# Altium project SensorNode.PrjPcb
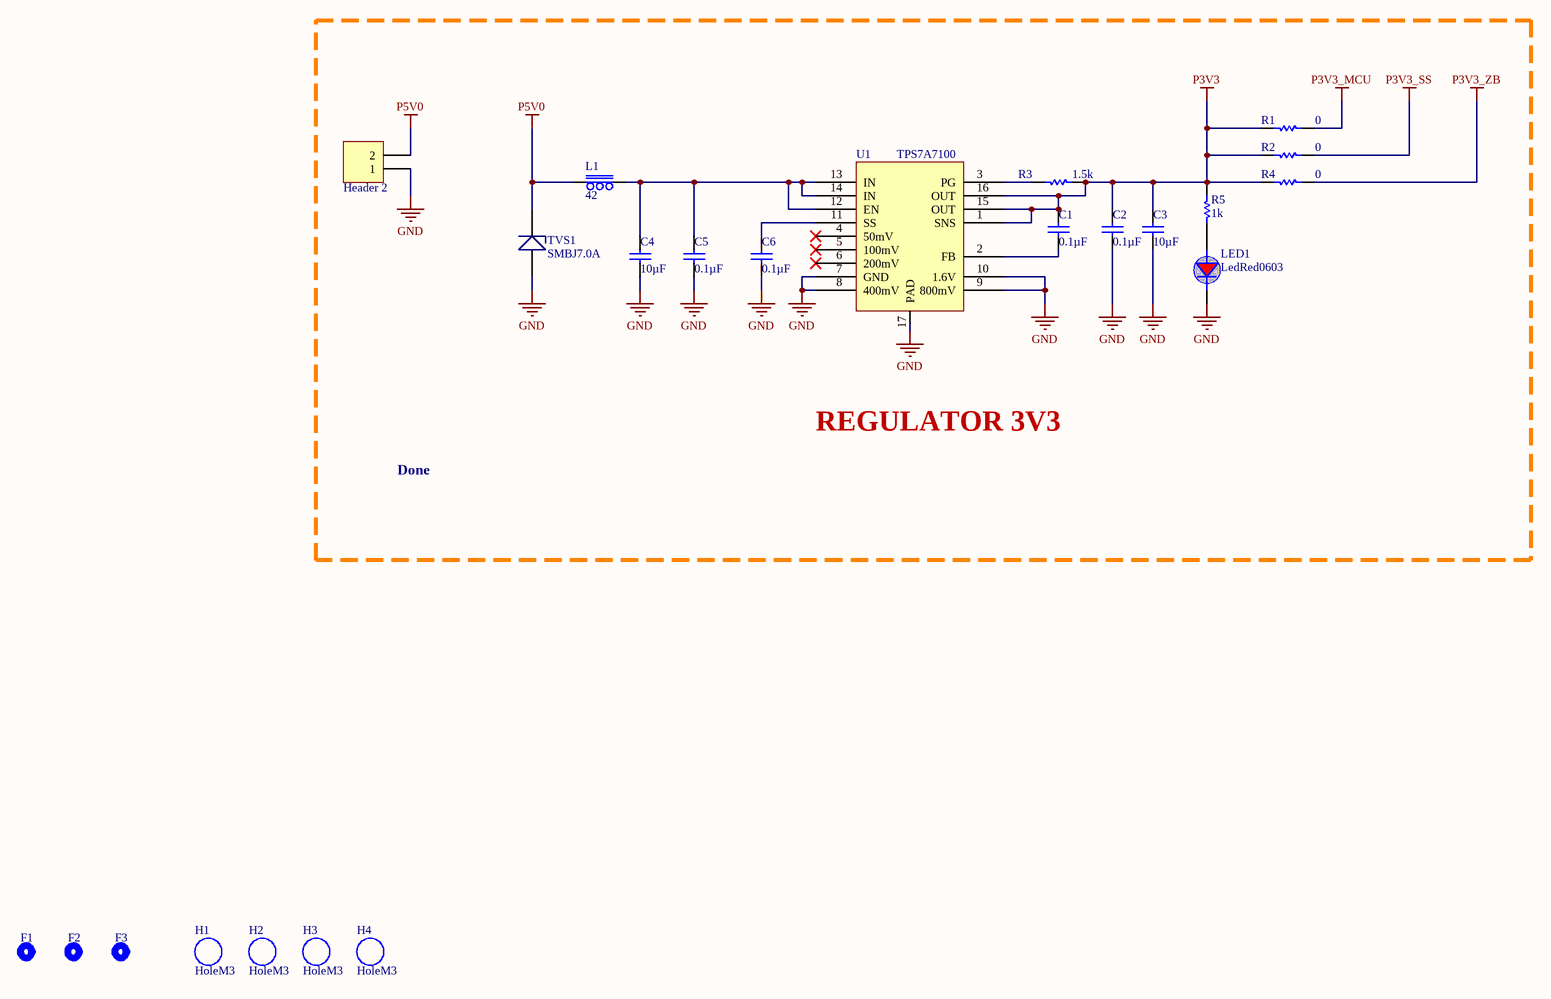
[diagram p0: POWER.SchDoc]
4 sheets, 86 parts. Net scope: flat (ports and power ports of the same name join across sheets).
Board file: SFarm.PcbDoc
Sheets:
  POWER.SchDoc
  MCU.SchDoc
  SENSOR.SchDoc
  CONNECTIVITY.SchDoc

## Sheet POWER.SchDoc
size A3; Organization: Altium Limited; Address1: L3, 12a Rodborough Rd; Address2: Frenchs Forest; Address3: NSW; Address4: Australia 2086; DocumentNumber: 2; SheetNumber: 2; SheetTotal: 5

### Parts
C1  0.1µF  [C0402M]
C2  0.1µF  [C0402M]
C3  10µF  [0805 cap]
C4  10µF  [0805 cap]
C5  0.1µF  [C0402M]
C6  0.1µF  [C0402M]
F1  (no value)  [fiducials]
F2  (no value)  [fiducials]
F3  (no value)  [fiducials]
H1  HoleM3  [HOLEM3via]
H2  HoleM3  [HOLEM3via]
H3  HoleM3  [HOLEM3via]
H4  HoleM3  [HOLEM3via]
L1  42  [0805F]
LED1  LedRed0603  [0603LED-RED]
P1  Header 2  [HED2T]
R1  0  [R0805M]
R2  0  [R0805M]
R3  1.5k  [R0603M]
R4  0  [R0805M]
R5  1k  [R0603M]
TVS1  SMBJ7.0A  [DIOM4436X26N]
U1  TPS7A7100  [QFN16]

### Blocks framed on the sheet
REGULATOR 3V3: C1-C6 L1 LED1 P1 R1-R5 TVS1 U1

### Nets
GND: C2.1 C3.1 C4.1 C5.1 C6.1 LED1.2(Katot) P1.1 TVS1.1 U1.7(GND) U1.8(400mV) U1.9(800mV) U1.10(1.6V) U1.17(PAD)
P3V3: C1.2 C2.2 C3.2 R1.1 R2.1 R3.2 R4.1 R5.2 U1.1(SNS) U1.15(OUT) U1.16(OUT)
P3V3_MCU: R1.2
P3V3_SS: R2.2
P3V3_ZB: R4.2
P5V0: L1.1 P1.2 TVS1.2
NetC1_1: C1.1 U1.2(FB)
NetC4_2: C4.2 C5.2 L1.2 U1.12(EN) U1.13(IN) U1.14(IN)
NetC6_2: C6.2 U1.11(SS)
NetLED1_1: LED1.1(anot) R5.1
NetR3_1: R3.1 U1.3(PG)

Not connected (* = marked no-connect by the designer): U1 4(50mV)* 5(100mV)* 6(200mV)*

### Notes on the sheet
- Done
- Title
- Size:
- Date:
- A3
- Number:
- Time:
- Revision:
- Sheet
- of
- File:

### Library data of the parts
C1 C2 C5 C6 = CAP0.1u0402: CAP CER 0.1UF 10V X7R 0402; Manufacturer: Taiyo Yuden; Manufacturer Part Number: LMK105B7104KVHF; Tolerance: ±10%; Supplier 1: Digi-Key; RoHS: RoHS Compliant; Category: Capacitors; Stock 1: 23930; Pricing 1: 1=0.1, 10=0.05, 100=0.0223, 500=0.01594, 1000=0.01252, 2500=0.01138, 5000=0.01047 (USD); Packaging: Cut Tape (CT); Part Status: Active; Capacitance: 0.1µF; Voltage - Rated: 10V; Temperature Coefficient: X7R; Operating Temperature: -55°C ~ 125°C; Features: -; Ratings: AEC-Q200; Applications: Automotive; Mounting Type: Surface Mount, MLCC; Package / Case: 0402 (1005 Metric); Size / Dimension: 0.039" L x 0.020" W (1.00mm x 0.50mm); Height - Seated (Max): -; Thickness (Max): 0.022" (0.55mm); Lead Spacing: -; Lead Style: -; ComponentLink1URL: http://www.yuden.co.jp/productdata/catalog/en/mlcc_all_hq_e.pdf; ComponentLink1Description: http://www.yuden.co.jp/productdata/catalog/en/mlcc_all_hq_e.pdf; Supplier Part Number 1: 587-3769-1-ND
C3 C4 = cap10u0805: CAP CER 10UF 16V X7R 0805; Manufacturer: Taiyo Yuden; Manufacturer Part Number: EMK212BB7106MG-T; Tolerance: ±20%; Supplier 1: Digi-Key; RoHS: RoHS Compliant; Category: Capacitors; Stock 1: 221600; Pricing 1: 1=0.51, 10=0.351, 100=0.2106, 500=0.15798, 1000=0.1334 (USD); Packaging: Cut Tape (CT); Part Status: Active; Capacitance: 10µF; Voltage - Rated: 16V; Temperature Coefficient: X7R; Operating Temperature: -55°C ~ 125°C; Features: -; Ratings: -; Applications: General Purpose; Mounting Type: Surface Mount, MLCC; Package / Case: 0805 (2012 Metric); Size / Dimension: 0.079" L x 0.049" W (2.00mm x 1.25mm); Height - Seated (Max): -; Thickness (Max): 0.053" (1.35mm); Lead Spacing: -; Lead Style: -; ComponentLink1URL: http://www.yuden.co.jp/productdata/catalog/en/mlcc06_e.pdf; ComponentLink1Description: http://www.yuden.co.jp/productdata/catalog/en/mlcc06_e.pdf; Supplier Part Number 1: 587-3319-1-ND
F1-F3 = Fiducials
L1 = Ferrite Bead: FERRITE BEAD 42 OHM 0805 1LN; Manufacturer: Taiyo Yuden; Manufacturer Part Number: FBMJ2125HS420-TV; Filter Type: Power Line; Number of Lines: 1; Impedance @ Frequency: 42 Ohm @ 100MHz; Current Rating (Max): 4A; DC Resistance (DCR) (Max): 8 mOhm; Supplier 1: Digi-Key; Supplier Part Number 1: 587-3851-6-ND; RoHS: RoHS Compliant; Category: Filters; Stock 1: 2013; Pricing 1: 1=0.2, 10=0.154, 25=0.1276, 50=0.11, 100=0.099, 250=0.0836, 500=0.0748, 1000=0.0638 (USD); Packaging: Digi-Reel®; Part Status: Active; Ratings: AEC-Q200; Operating Temperature: -40°C ~ 125°C; Package / Case: 0805 (2012 Metric); Mounting Type: Surface Mount; Height (Max): 0.041" (1.05mm); Size / Dimension: 0.079" L x 0.049" W (2.00mm x 1.25mm); ComponentLink1URL: http://ds.yuden.co.jp/TYCOMPAS/ut/detail.do?productNo=FBMJ2125HS420-TV&fileName=FBMJ2125HS420-TV_SS&mode=specSheetDownload; ComponentLink1Description: http://ds.yuden.co.jp/TYCOMPAS/ut/detail.do?productNo=FBMJ2125HS420-TV&fileName=FBMJ2125HS420-TV_SS&mode=specSheetDownload
LED1 = LedRed0603: LED RED CLEAR 0603 SMD; Manufacturer: Everlight Electronics Co Ltd; Manufacturer Part Number: QTLP600C7TR; Lens Color: Colorless; Millicandela Rating: 20mcd; Lens Style/Size: Rectangle with Flat Top, 1.20mm x 0.80mm; Voltage - Forward (Vf) (Typ): 1.9V; Current - Test: 20mA; Viewing Angle: 100°; Wavelength - Dominant: 645nm; Wavelength - Peak: 660nm; Supplier 1: Digi-Key; RoHS: RoHS Compliant; Category: Optoelectronics; Stock 1: 19325; Pricing 1: 1=0.41, 10=0.297, 25=0.2276, 100=0.1485, 250=0.10892, 500=0.0924, 1000=0.0759 (USD); Packaging: Cut Tape (CT); Part Status: Active; Color: Red; Lens Transparency: Clear; Mounting Type: Surface Mount; Features: -; Package / Case: 0603 (1608 Metric); Size / Dimension: 1.60mm L x 0.80mm W; Height (Max): 0.80mm; ComponentLink1URL: http://media.digikey.com/pdf/Data%20Sheets/Everlight%20PDFs/QTLP600C.pdf; ComponentLink1Description: http://media.digikey.com/pdf/Data%20Sheets/Everlight%20PDFs/QTLP600C.pdf; Supplier Part Number 1: 1080-1400-1-ND
P1 = Header 2: Header, 2-Pin
R1 R2 R4 = RES00805: RES SMD 0.0 OHM JUMPER 1/8W 0805; Manufacturer: Panasonic Electronic Components; Manufacturer Part Number: ERJ-6GEY0R00V; Resistance (Ohms): 0.0; Power (Watts): 0.125W, 1/8W; Supplier 1: Digi-Key; RoHS: RoHS Compliant; Category: Resistors; Stock 1: 562130; Pricing 1: 1=0.1, 10=0.024, 25=0.0172, 50=0.0132, 100=0.0097, 250=0.00744, 500=0.00594, 1000=0.00437 (USD); Packaging: Cut Tape (CT); Part Status: Active; Tolerance: Jumper; Composition: Thick Film; Features: Automotive AEC-Q200; Temperature Coefficient: -; Operating Temperature: -55°C ~ 155°C; Package / Case: 0805 (2012 Metric); Supplier Device Package: 0805; Size / Dimension: 0.079" L x 0.049" W (2.00mm x 1.25mm); Height - Seated (Max): 0.028" (0.70mm); Failure Rate: -; ComponentLink1URL: http://industrial.panasonic.com/www-cgi/jvcr13pz.cgi?E+PZ+3+AOA0001+ERJ6GEY0R00V+7+WW; ComponentLink1Description: http://industrial.panasonic.com/www-cgi/jvcr13pz.cgi?E+PZ+3+AOA0001+ERJ6GEY0R00V+7+WW; Supplier Part Number 1: P0.0ACT-ND
R3 = RES1k50603: RES SMD 1.5K OHM 1% 1/10W 0603; Manufacturer: Panasonic Electronic Components; Manufacturer Part Number: ERJ-3EKF1501V; Power (Watts): 0.1W, 1/10W; Temperature Coefficient: ±100ppm/°C; Supplier 1: Digi-Key; RoHS: RoHS Compliant; Category: Resistors; Stock 1: 0; Pricing 1: 1=0.1, 10=0.021, 100=0.0087, 1000=0.00389, 2500=0.00338 (USD); Packaging: Cut Tape (CT); Part Status: Active; Resistance (Ohms): 1.5k; Tolerance: ±1%; Composition: Thick Film; Features: Automotive AEC-Q200; Operating Temperature: -55°C ~ 155°C; Package / Case: 0603 (1608 Metric); Supplier Device Package: 0603; Size / Dimension: 0.063" L x 0.031" W (1.60mm x 0.80mm); Height - Seated (Max): 0.022" (0.55mm); Failure Rate: -; ComponentLink1URL: https://industrial.panasonic.com/cdbs/www-data/pdf/RDA0000/AOA0000C298.pdf; ComponentLink1Description: https://industrial.panasonic.com/cdbs/www-data/pdf/RDA0000/AOA0000C298.pdf; Supplier Part Number 1: P1.50KHCT-ND
R5 = RES1k0603: RES SMD 1K OHM 1% 1/10W 0603; Manufacturer: Panasonic Electronic Components; Manufacturer Part Number: ERJ-3EKF1001V; Power (Watts): 0.1W, 1/10W; Temperature Coefficient: ±100ppm/°C; Supplier 1: Digi-Key; RoHS: RoHS Compliant; Category: Resistors; Stock 1: 0; Pricing 1: 1=0.1, 10=0.021, 100=0.0087, 1000=0.00389, 2500=0.00338 (USD); Packaging: Digi-Reel®; Part Status: Active; Resistance (Ohms): 1k; Tolerance: ±1%; Composition: Thick Film; Features: Automotive AEC-Q200; Operating Temperature: -55°C ~ 155°C; Package / Case: 0603 (1608 Metric); Supplier Device Package: 0603; Size / Dimension: 0.063" L x 0.031" W (1.60mm x 0.80mm); Height - Seated (Max): 0.022" (0.55mm); Failure Rate: -; ComponentLink1URL: https://industrial.panasonic.com/cdbs/www-data/pdf/RDA0000/AOA0000C298.pdf; ComponentLink1Description: https://industrial.panasonic.com/cdbs/www-data/pdf/RDA0000/AOA0000C298.pdf; Supplier Part Number 1: P1.00KHDKR-ND
TVS1 = TVS: TVS DIODE 7V 12V DO214AA; Manufacturer 1: Littelfuse Inc.; Category 1: Circuit Protection; Voltage - Breakdown (Min): 7.78V; Current - Peak Pulse (10/1000µs): 50A; Power - Peak Pulse: 600W; Power Line Protection: No; Supplier 1: Digi-Key; Manufacturer Part Number 1: SMBJ7.0A; RoHS 1: RoHS Compliant; Description 1: TVS DIODE 7V 12V DO214AA; Stock 1: 18983; Pricing 1: 1=0.42, 10=0.327, 25=0.2756, 100=0.2244, 250=0.18588, 500=0.15384, 1000=0.11538 (USD); Packaging: Cut Tape (CT); Part Status: Active; Type: Zener; Voltage - Reverse Standoff (Typ): 7V; Voltage - Clamping (Max) @ Ipp: 12V; Applications: General Purpose; Capacitance @ Frequency: -; Operating Temperature: -65°C ~ 150°C (TJ); Mounting Type: Surface Mount; Package / Case: DO-214AA, SMB; Supplier Device Package: DO-214AA (SMBJ); ComponentLink1URL: http://www.littelfuse.com/~/media/electronics/datasheets/tvs_diodes/littelfuse_tvs_diode_smbj_datasheet.pdf.pdf; ComponentLink1Description: http://www.littelfuse.com/~/media/electronics/datasheets/tvs_diodes/littelfuse_tvs_diode_smbj_datasheet.pdf.pdf; Supplier Part Number 1: SMBJ7.0ALFCT-ND
U1 = TPS7A7100: IC REG LDO FIX/ADJ 1A 16QFN; Manufacturer: Texas Instruments; Manufacturer Part Number: TPS7A7100RGTR; Regulator Topology: Positive Fixed or Adjustable; Voltage - Output: 0.9 V ~ 5 V; Voltage - Input: 1.425 V ~ 6.5 V; Current - Limit (Min): 1.1A; Supplier 1: Digi-Key; RoHS: RoHS Compliant; Category: Integrated Circuits (ICs); Stock 1: 5133; Pricing 1: 1=2.19, 10=1.965, 100=1.5796, 500=1.2978, 1000=1.07532 (USD); Packaging: Cut Tape (CT); Part Status: Active; Current - Output: 1A; Voltage - Dropout (Typical): -; Operating Temperature: -40°C ~ 125°C; Mounting Type: Surface Mount; Package / Case: 16-VFQFN Exposed Pad; Supplier Device Package: 16-QFN (3x3); ComponentLink1URL: http://www.ti.com/lit/ds/symlink/tps7a7100.pdf; ComponentLink1Description: http://www.ti.com/lit/ds/symlink/tps7a7100.pdf; Supplier Part Number 1: 296-40978-1-ND

## Sheet MCU.SchDoc
size A3; Organization: Altium Limited; Address1: L3, 12a Rodborough Rd; Address2: Frenchs Forest; Address3: NSW; Address4: Australia 2086; DocumentNumber: 3; SheetNumber: 3; SheetTotal: 5
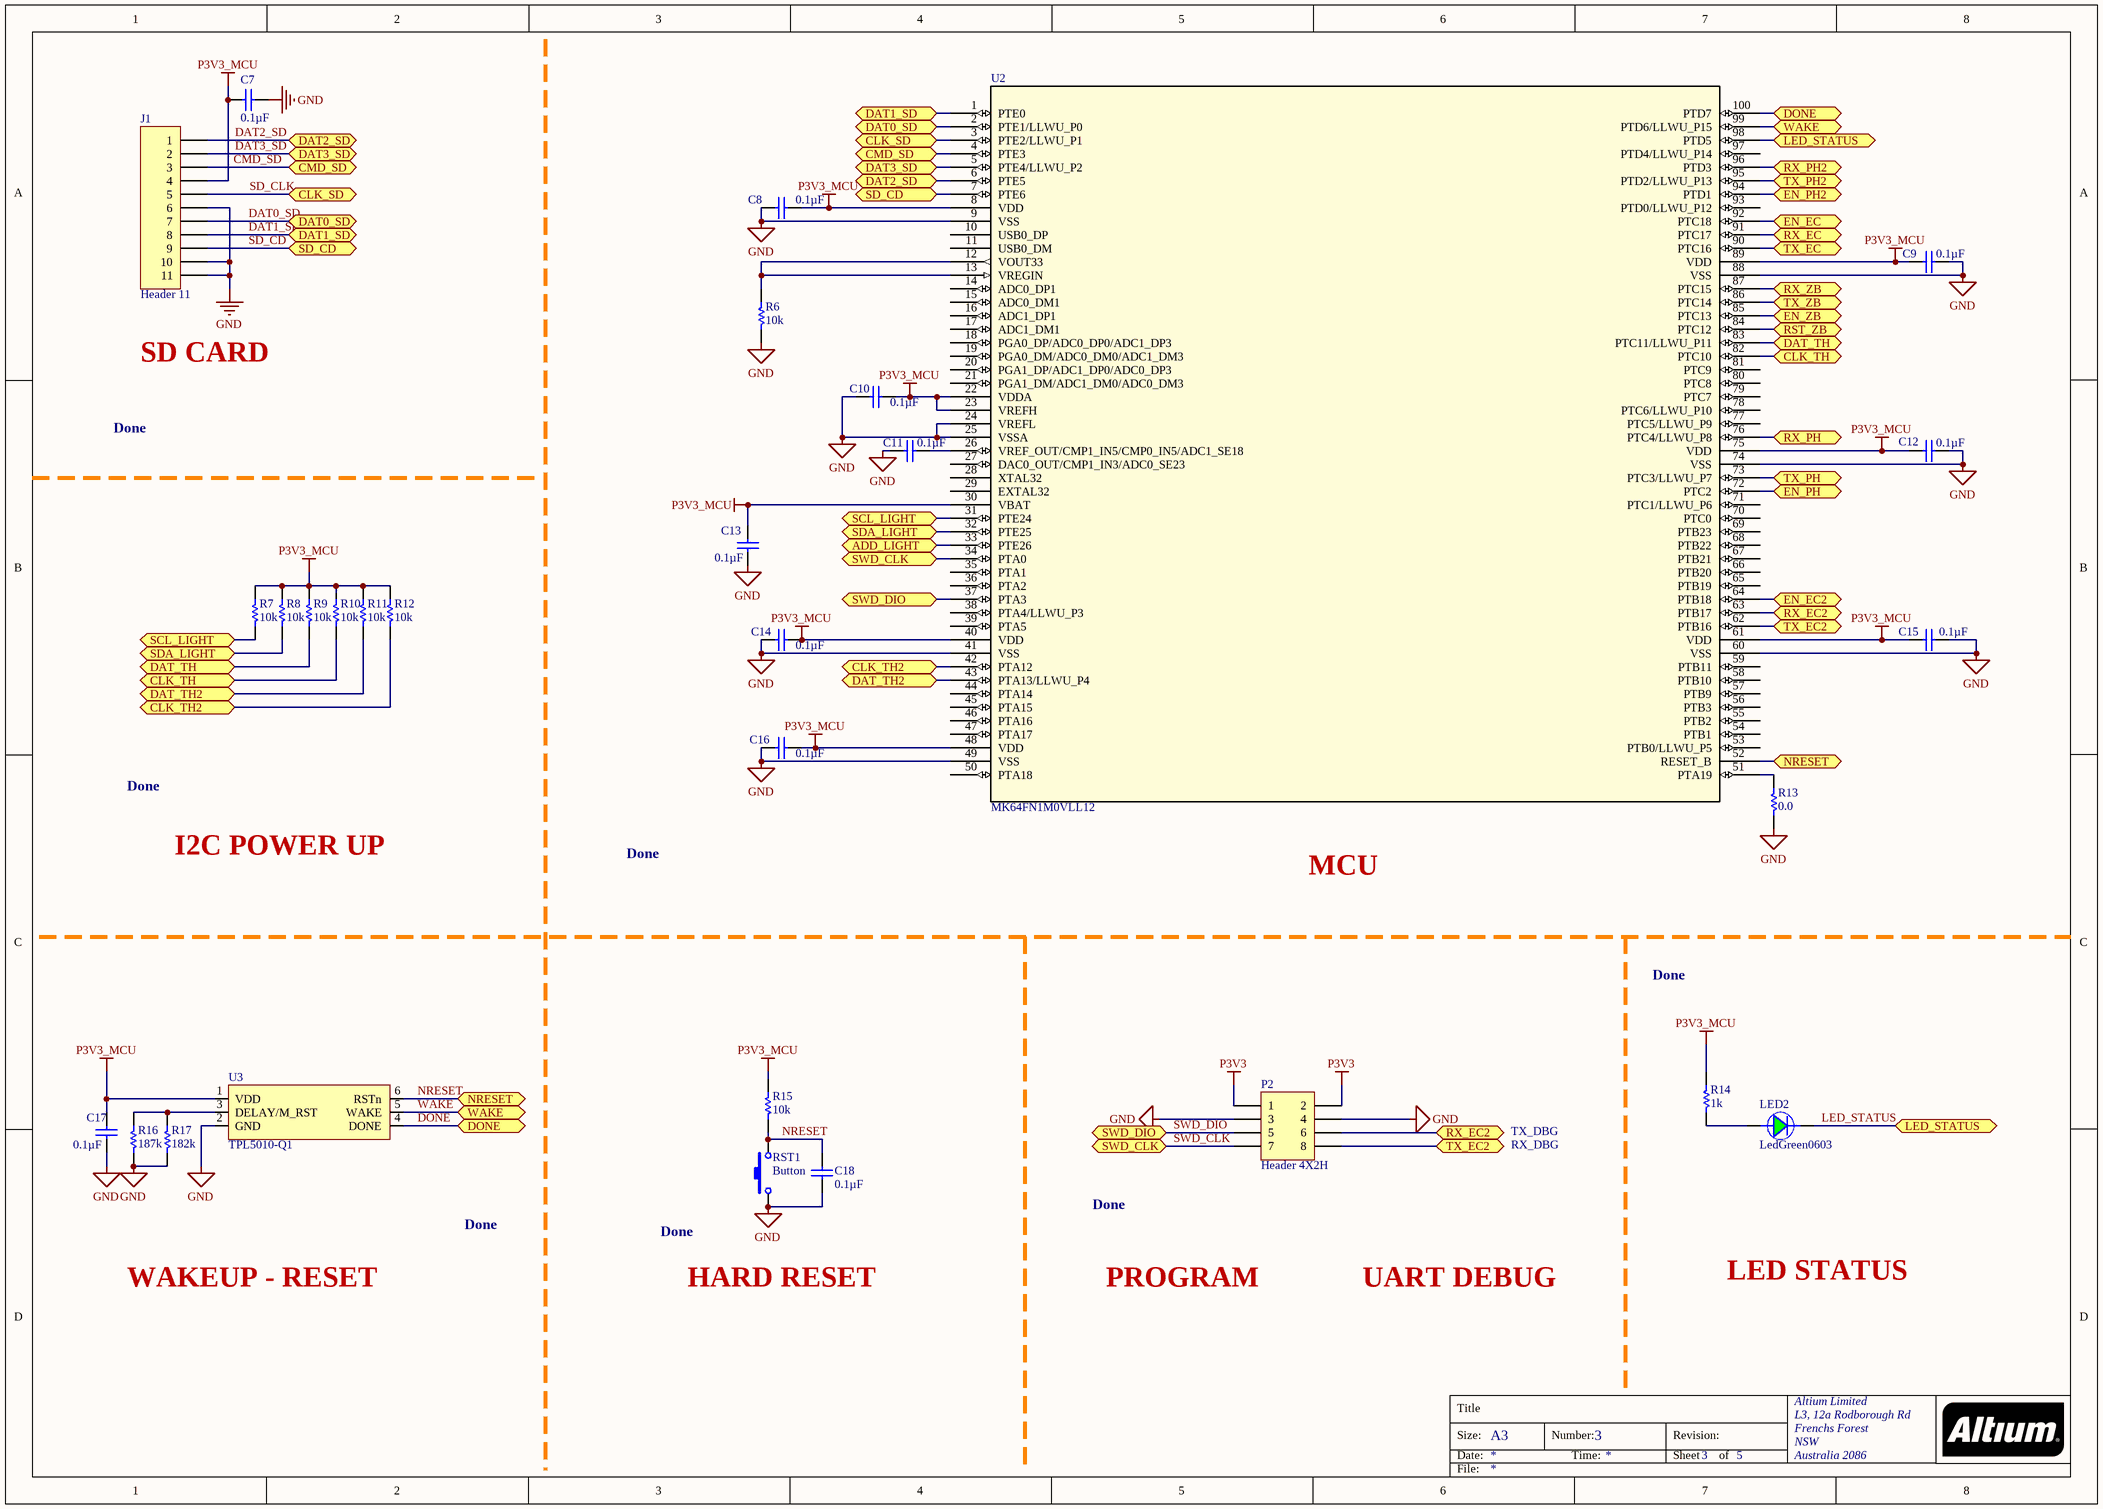
[diagram p1: MCU.SchDoc]

### Parts
C7  0.1µF  [C0402M]
C8  0.1µF  [C0402M]
C9  0.1µF  [C0402M]
C10  0.1µF  [C0402M]
C11  0.1µF  [C0402M]
C12  0.1µF  [C0402M]
C13  0.1µF  [C0402M]
C14  0.1µF  [C0402M]
C15  0.1µF  [C0402M]
C16  0.1µF  [C0402M]
C17  0.1µF  [C0402M]
C18  0.1µF  [C0402M]
J1  Header 11  [TF_V3]
LED2  LedGreen0603  [0603LED-GREEN]
P2  Header 4X2H  [HDR2X4]
R6  10k  [R0603M]
R7  10k  [R0603M]
R8  10k  [R0603M]
R9  10k  [R0603M]
R10  10k  [R0603M]
R11  10k  [R0603M]
R12  10k  [R0603M]
R13  0.0  [R0603M]
R14  1k  [R0603M]
R15  10k  [R0603M]
R16  187k  [R0603M]
R17  182k  [R0603M]
RST1  Button  [SWSMD]
U2  MK64FN1M0VLL12  [LQFP-100_14X14X1]
U3  TPL5010-Q1  [SOT23-6]

### Ports
ADD_LIGHT, CLK_SD, CLK_TH, CLK_TH2, CMD_SD, DAT0_SD, DAT1_SD, DAT2_SD, DAT3_SD, DAT_TH, DAT_TH2, DONE, EN_EC, EN_EC2, EN_PH, EN_PH2, EN_ZB, LED_STATUS, NRESET, RST_ZB, RX_EC, RX_EC2, RX_PH, RX_PH2, RX_ZB, SCL_LIGHT, SD_CD, SDA_LIGHT, SWD_CLK, SWD_DIO, TX_EC, TX_EC2, TX_PH, TX_PH2, TX_ZB, WAKE

### Nets
GND: C7.2 C8.2 C9.2 C10.2 C11.2 C12.2 C13.2 C14.1 C15.2 C16.1 C17.1 C18.1 J1.6 J1.10 J1.11 P2.3 P2.4 R6.1 R13.1 R16.1 R17.1 RST1.1 U2.9(VSS) U2.24(VREFL) U2.25(VSSA) U2.41(VSS) U2.49(VSS) U2.60(VSS) U2.74(VSS) U2.88(VSS) U3.2(GND)
P3V3: P2.1 P2.2
P3V3_MCU: C7.1 C8.1 C9.1 C10.1 C12.1 C13.1 C14.2 C15.1 C16.2 C17.2 J1.4 R7.2 R8.2 R9.2 R10.2 R11.2 R12.2 R14.1 R15.1 U2.8(VDD) U2.22(VDDA) U2.23(VREFH) U2.30(VBAT) U2.40(VDD) U2.48(VDD) U2.61(VDD) U2.75(VDD) U2.89(VDD) U3.1(VDD)
ADD_LIGHT: U2.33(PTE26) ; port ADD_LIGHT
CLK_TH: R10.1 U2.82(PTC10) ; port CLK_TH
CLK_TH2: R12.1 U2.42(PTA12) ; port CLK_TH2
CMD_SD: J1.3 U2.4(PTE3) ; port CMD_SD
DAT0_SD: J1.7 U2.2(PTE1/LLWU_P0) ; port DAT0_SD
DAT1_SD: J1.8 U2.1(PTE0) ; port DAT1_SD
DAT2_SD: J1.1 U2.6(PTE5) ; port DAT2_SD
DAT3_SD: J1.2 U2.5(PTE4/LLWU_P2) ; port DAT3_SD
DAT_TH: R9.1 U2.83(PTC11/LLWU_P11) ; port DAT_TH
DAT_TH2: R11.1 U2.43(PTA13/LLWU_P4) ; port DAT_TH2
DONE: U2.100(PTD7) U3.4(DONE) ; port DONE
EN_EC: U2.92(PTC18) ; port EN_EC
EN_PH: U2.72(PTC2) ; port EN_PH
EN_PH2: U2.94(PTD1) ; port EN_PH2
EN_ZB: U2.85(PTC13) ; port EN_ZB
LED_STATUS: LED2.2(Katot) U2.98(PTD5) ; port LED_STATUS
NRESET: C18.2 R15.2 RST1.2 U2.52(RESET_B) U3.6(RSTn) ; port NRESET
RX_EC: U2.91(PTC17) ; port RX_EC
RX_EC2: P2.6 U2.63(PTB17) ; port RX_EC2
RX_PH: U2.76(PTC4/LLWU_P8) ; port RX_PH
RX_PH2: U2.96(PTD3) ; port RX_PH2
SCL_LIGHT: R7.1 U2.31(PTE24) ; port SCL_LIGHT
SD_CD: J1.9 U2.7(PTE6) ; port SD_CD
SD_CLK: J1.5 U2.3(PTE2/LLWU_P1) ; port CLK_SD
SDA_LIGHT: R8.1 U2.32(PTE25) ; port SDA_LIGHT
SWD_CLK: P2.7 U2.34(PTA0) ; port SWD_CLK
SWD_DIO: P2.5 U2.37(PTA3) ; port SWD_DIO
TX_EC: U2.90(PTC16) ; port TX_EC
TX_EC2: P2.8 U2.62(PTB16) ; port TX_EC2
TX_PH: U2.73(PTC3/LLWU_P7) ; port TX_PH
TX_PH2: U2.95(PTD2/LLWU_P13) ; port TX_PH2
WAKE: U2.99(PTD6/LLWU_P15) U3.5(WAKE) ; port WAKE
NetC11_1: C11.1 U2.26(VREF_OUT/CMP1_IN5/CMP0_IN5/ADC1_SE18)
NetLED2_1: LED2.1(anot) R14.2
NetQ4_1: U2.64(PTB18) ; port EN_EC2
NetR6_2: R6.2 U2.12(VOUT33) U2.13(VREGIN)
NetR13_2: R13.2 U2.51(PTA19)
NetR16_2: R16.2 R17.2 U3.3(DELAY/M_RST)
NetU2_84: U2.84(PTC12) ; port RST_ZB
NetU2_86: U2.86(PTC14) ; port TX_ZB
NetU2_87: U2.87(PTC15) ; port RX_ZB

Not connected (* = marked no-connect by the designer): U2 10(USB0_DP) 11(USB0_DM) 14(ADC0_DP1) 15(ADC0_DM1) 16(ADC1_DP1) 17(ADC1_DM1) 18(PGA0_DP/ADC0_DP0/ADC1_DP3) 19(PGA0_DM/ADC0_DM0/ADC1_DM3) 20(PGA1_DP/ADC1_DP0/ADC0_DP3) 21(PGA1_DM/ADC1_DM0/ADC0_DM3) 27(DAC0_OUT/CMP1_IN3/ADC0_SE23) 28(XTAL32) 29(EXTAL32) 35(PTA1) 36(PTA2) 38(PTA4/LLWU_P3) 39(PTA5) 44(PTA14) 45(PTA15) 46(PTA16) 47(PTA17) 50(PTA18) 53(PTB0/LLWU_P5) 54(PTB1) 55(PTB2) 56(PTB3) 57(PTB9) 58(PTB10) 59(PTB11) 65(PTB19) 66(PTB20) 67(PTB21) 68(PTB22) 69(PTB23) 70(PTC0) 71(PTC1/LLWU_P6) 77(PTC5/LLWU_P9) 78(PTC6/LLWU_P10) 79(PTC7) 80(PTC8) 81(PTC9) 93(PTD0/LLWU_P12) 97(PTD4/LLWU_P14)

### Notes on the sheet
- SD CARD
- Done
- I2C POWER UP
- MCU
- TX_DBG
- RX_DBG
- WAKEUP - RESET
- HARD RESET
- PROGRAM
- UART DEBUG
- LED STATUS
- Title
- Size:
- Date:
- A3
- Number:
- Time:
- Revision:
- Sheet
- of
- File:

### Library data of the parts
C7-C18 = CAP0.1u0402: as C1 on sheet POWER; Supplier 1: Digi-Key; RoHS: RoHS Compliant; Category: Capacitors; Stock 1: 23930; Pricing 1: 1=0.1, 10=0.05, 100=0.0223, 500=0.01594, 1000=0.01252, 2500=0.01138, 5000=0.01047 (USD); Packaging: Cut Tape (CT); Part Status: Active; Capacitance: 0.1µF; Voltage - Rated: 10V; Temperature Coefficient: X7R; Operating Temperature: -55°C ~ 125°C; Features: -; Ratings: AEC-Q200; Applications: Automotive; Mounting Type: Surface Mount, MLCC; Package / Case: 0402 (1005 Metric); Size / Dimension: 0.039" L x 0.020" W (1.00mm x 0.50mm); Height - Seated (Max): -; Thickness (Max): 0.022" (0.55mm); Lead Spacing: -; Lead Style: -; ComponentLink1URL: http://www.yuden.co.jp/productdata/catalog/en/mlcc_all_hq_e.pdf; ComponentLink1Description: http://www.yuden.co.jp/productdata/catalog/en/mlcc_all_hq_e.pdf; Supplier Part Number 1: 587-3769-1-ND
J1 = Header 11: Header, 11-Pin; Module: Micro-SD; LatestRevisionDate: 17-Jul-2002; LatestRevisionNote: Re-released for DXP Platform.; Publisher: Altium Limited
LED2 = LedGreen0603: LED GREEN CLEAR 0603 SMD; Manufacturer: Everlight Electronics Co Ltd; Manufacturer Part Number: QTLP601C4TR; Lens Color: Colorless; Millicandela Rating: 15mcd; Lens Style/Size: Rectangle with Flat Top, 1.20mm x 0.80mm; Voltage - Forward (Vf) (Typ): 2.1V; Current - Test: 20mA; Viewing Angle: 120°; Wavelength - Dominant: 570nm; Wavelength - Peak: 565nm; Supplier 1: Digi-Key; RoHS: RoHS Compliant; Category: Optoelectronics; Stock 1: 19080; Pricing 1: 1=0.51, 10=0.366, 25=0.2808, 100=0.1832, 250=0.13432, 500=0.11396, 1000=0.09361 (USD); Packaging: Cut Tape (CT); Part Status: Active; Color: Green; Lens Transparency: Clear; Mounting Type: Surface Mount; Features: -; Package / Case: 0603 (1608 Metric); Supplier Device Package: 0603; Size / Dimension: 1.60mm L x 0.80mm W; Height (Max): 0.60mm; ComponentLink1URL: http://media.digikey.com/pdf/Data%20Sheets/Everlight%20PDFs/QTLP601C-2,3,4,7,B.pdf; ComponentLink1Description: http://media.digikey.com/pdf/Data%20Sheets/Everlight%20PDFs/QTLP601C-2,3,4,7,B.pdf; Supplier Part Number 1: 1080-1405-1-ND
P2 = Header 4X2H: Header, 4-Pin, Dual row, Right Angle; LatestRevisionDate: 17-Jul-2002; LatestRevisionNote: Re-released for DXP Platform.; Publisher: Altium Limited
R6-R12 R15 = RES10k0603: RES SMD 10K OHM 1% 1/10W 0603; Manufacturer: Panasonic Electronic Components; Manufacturer Part Number: ERJ-3EKF1002V; Power (Watts): 0.1W, 1/10W; Temperature Coefficient: ±100ppm/°C; Supplier 1: Digi-Key; RoHS: RoHS Compliant; Category: Resistors; Stock 1: 0; Pricing 1: 1=0.1, 10=0.021, 100=0.0087, 1000=0.00389, 2500=0.00338 (USD); Packaging: Digi-Reel®; Part Status: Active; Resistance (Ohms): 10k; Tolerance: ±1%; Composition: Thick Film; Features: Automotive AEC-Q200; Operating Temperature: -55°C ~ 155°C; Package / Case: 0603 (1608 Metric); Supplier Device Package: 0603; Size / Dimension: 0.063" L x 0.031" W (1.60mm x 0.80mm); Height - Seated (Max): 0.022" (0.55mm); Failure Rate: -; ComponentLink1URL: https://industrial.panasonic.com/cdbs/www-data/pdf/RDA0000/AOA0000C298.pdf; ComponentLink1Description: https://industrial.panasonic.com/cdbs/www-data/pdf/RDA0000/AOA0000C298.pdf; Supplier Part Number 1: P10.0KHDKR-ND
R13 = RES00603: RES SMD 0.0OHM JUMPER 1/10W 0603; Manufacturer: Panasonic Electronic Components; Manufacturer Part Number: ERJ-3GEY0R00V; Power (Watts): 0.1W, 1/10W; Supplier 1: Digi-Key; RoHS: RoHS Compliant; Category: Resistors; Stock 1: 8597757; Pricing 1: 1=0.1, 10=0.016, 25=0.0116, 50=0.0088, 100=0.0065, 250=0.00496, 500=0.00396, 1000=0.00292 (USD); Packaging: Cut Tape (CT); Part Status: Active; Resistance (Ohms): 0.0; Tolerance: Jumper; Composition: Thick Film; Features: Automotive AEC-Q200; Temperature Coefficient: -; Operating Temperature: -55°C ~ 155°C; Package / Case: 0603 (1608 Metric); Supplier Device Package: 0603; Size / Dimension: 0.063" L x 0.031" W (1.60mm x 0.80mm); Height - Seated (Max): 0.022" (0.55mm); Failure Rate: -; ComponentLink1URL: http://industrial.panasonic.com/www-cgi/jvcr13pz.cgi?E+PZ+3+AOA0001+ERJ3GEY0R00V+7+WW; ComponentLink1Description: http://industrial.panasonic.com/www-cgi/jvcr13pz.cgi?E+PZ+3+AOA0001+ERJ3GEY0R00V+7+WW; Supplier Part Number 1: P0.0GCT-ND
R14 = RES1k0603: as R5 on sheet POWER; Supplier 1: Digi-Key; RoHS: RoHS Compliant; Category: Resistors; Stock 1: 0; Pricing 1: 1=0.1, 10=0.021, 100=0.0087, 1000=0.00389, 2500=0.00338 (USD); Packaging: Digi-Reel®; Part Status: Active; Resistance (Ohms): 1k; Tolerance: ±1%; Composition: Thick Film; Features: Automotive AEC-Q200; Operating Temperature: -55°C ~ 155°C; Package / Case: 0603 (1608 Metric); Supplier Device Package: 0603; Size / Dimension: 0.063" L x 0.031" W (1.60mm x 0.80mm); Height - Seated (Max): 0.022" (0.55mm); Failure Rate: -; ComponentLink1URL: https://industrial.panasonic.com/cdbs/www-data/pdf/RDA0000/AOA0000C298.pdf; ComponentLink1Description: https://industrial.panasonic.com/cdbs/www-data/pdf/RDA0000/AOA0000C298.pdf; Supplier Part Number 1: P1.00KHDKR-ND
R16 = Resistor: RES SMD 187K OHM 1% 1/10W 0603; Manufacturer: Panasonic Electronic Components; Manufacturer Part Number: ERJ-3EKF1873V; Power (Watts): 0.1W, 1/10W; Temperature Coefficient: ±100ppm/°C; Supplier 1: Digi-Key; Supplier Part Number 1: P187KHCT-ND; RoHS: RoHS Compliant; Category: Resistors; Stock 1: 17711; Pricing 1: 1=0.1, 10=0.021, 100=0.0087, 1000=0.00389, 2500=0.00338 (USD); Packaging: Cut Tape (CT); Part Status: Active; Resistance (Ohms): 187k; Tolerance: ±1%; Composition: Thick Film; Features: Automotive AEC-Q200; Operating Temperature: -55°C ~ 155°C; Package / Case: 0603 (1608 Metric); Supplier Device Package: 0603; Size / Dimension: 0.063" L x 0.031" W (1.60mm x 0.80mm); Height - Seated (Max): 0.022" (0.55mm); Failure Rate: -; ComponentLink1URL: https://industrial.panasonic.com/cdbs/www-data/pdf/RDA0000/AOA0000C298.pdf; ComponentLink1Description: https://industrial.panasonic.com/cdbs/www-data/pdf/RDA0000/AOA0000C298.pdf
R17 = Resistor: RES SMD 182K OHM 1% 1/10W 0603; Manufacturer: Panasonic Electronic Components; Manufacturer Part Number: ERJ-3EKF1823V; Power (Watts): 0.1W, 1/10W; Temperature Coefficient: ±100ppm/°C; Supplier 1: Digi-Key; Supplier Part Number 1: P182KHCT-ND; RoHS: RoHS Compliant; Category: Resistors; Stock 1: 140068; Pricing 1: 1=0.1, 10=0.021, 100=0.0087, 1000=0.00389, 2500=0.00338 (USD); Packaging: Cut Tape (CT); Part Status: Active; Resistance (Ohms): 182k; Tolerance: ±1%; Composition: Thick Film; Features: Automotive AEC-Q200; Operating Temperature: -55°C ~ 155°C; Package / Case: 0603 (1608 Metric); Supplier Device Package: 0603; Size / Dimension: 0.063" L x 0.031" W (1.60mm x 0.80mm); Height - Seated (Max): 0.022" (0.55mm); Failure Rate: -; ComponentLink1URL: https://industrial.panasonic.com/cdbs/www-data/pdf/RDA0000/AOA0000C298.pdf; ComponentLink1Description: https://industrial.panasonic.com/cdbs/www-data/pdf/RDA0000/AOA0000C298.pdf
U2 = MK64FN1M0VLL12: IC MCU 32BIT 1MB FLASH 100LQFP; Manufacturer: NXP USA Inc.; Core Processor: ARM® Cortex®-M4; Core Size: 32-Bit; Speed: 120MHz; Connectivity: CAN, EBI/EMI, Ethernet, I²C, IrDA, SD, SPI, UART/USART, USB, USB OTG; Peripherals: DMA, I²S, LVD, POR, PWM, WDT; Number of I/O: 66; Program Memory Size: 1MB (1M x 8); RAM Size: 256K x 8; Voltage - Supply (Vcc/Vdd): 1.71 V ~ 3.6 V; Data Converters: A/D 32x16b, D/A 1x12b; Oscillator Type: Internal; Supplier 1: Digi-Key; Manufacturer Part Number: MK64FN1M0VLL12; RoHS: RoHS Compliant; Category: Integrated Circuits (ICs); Stock 1: 0; Pricing 1: 1=13, 10=11.947, 100=10.7003 (USD); Packaging: Tray; Part Status: Active; Program Memory Type: FLASH; EEPROM Size: -; Operating Temperature: -40°C ~ 105°C (TA); Package / Case: 100-LQFP; Supplier Device Package: 100-LQFP (14x14); ComponentLink1URL: http://cache.freescale.com/files/microcontrollers/doc/data_sheet/K64P144M120SF5.pdf; ComponentLink1Description: http://cache.freescale.com/files/microcontrollers/doc/data_sheet/K64P144M120SF5.pdf; Supplier Part Number 1: MK64FN1M0VLL12-ND
U3 = TPL5010: IC TIMER W/WATCHDOG 6SOT; Manufacturer: Texas Instruments; Manufacturer Part Number: TPL5010QDDCRQ1; Voltage - Supply: 1.8 V ~ 5 V; Current - Supply: 35nA; Supplier 1: Digi-Key; RoHS: RoHS Compliant; Category: Integrated Circuits (ICs); Stock 1: 2785; Pricing 1: 1=1.27, 10=1.136, 100=0.886, 500=0.73192, 1000=0.57783 (USD); Packaging: Cut Tape (CT); Part Status: Active; Type: Programmable Timer; Count: -; Frequency: -; Operating Temperature: -40°C ~ 125°C; Package / Case: SOT-23-6 Thin, TSOT-23-6; Supplier Device Package: TSOT-23-6; Mounting Type: Surface Mount; ComponentLink1URL: http://www.ti.com/lit/ds/symlink/tpl5010-q1.pdf; ComponentLink1Description: http://www.ti.com/lit/ds/symlink/tpl5010-q1.pdf; Supplier Part Number 1: 296-44963-1-ND

## Sheet SENSOR.SchDoc
size A3; Organization: Altium Limited; Address1: L3, 12a Rodborough Rd; Address2: Frenchs Forest; Address3: NSW; Address4: Australia 2086; DocumentNumber: 4; SheetNumber: 4; SheetTotal: 5
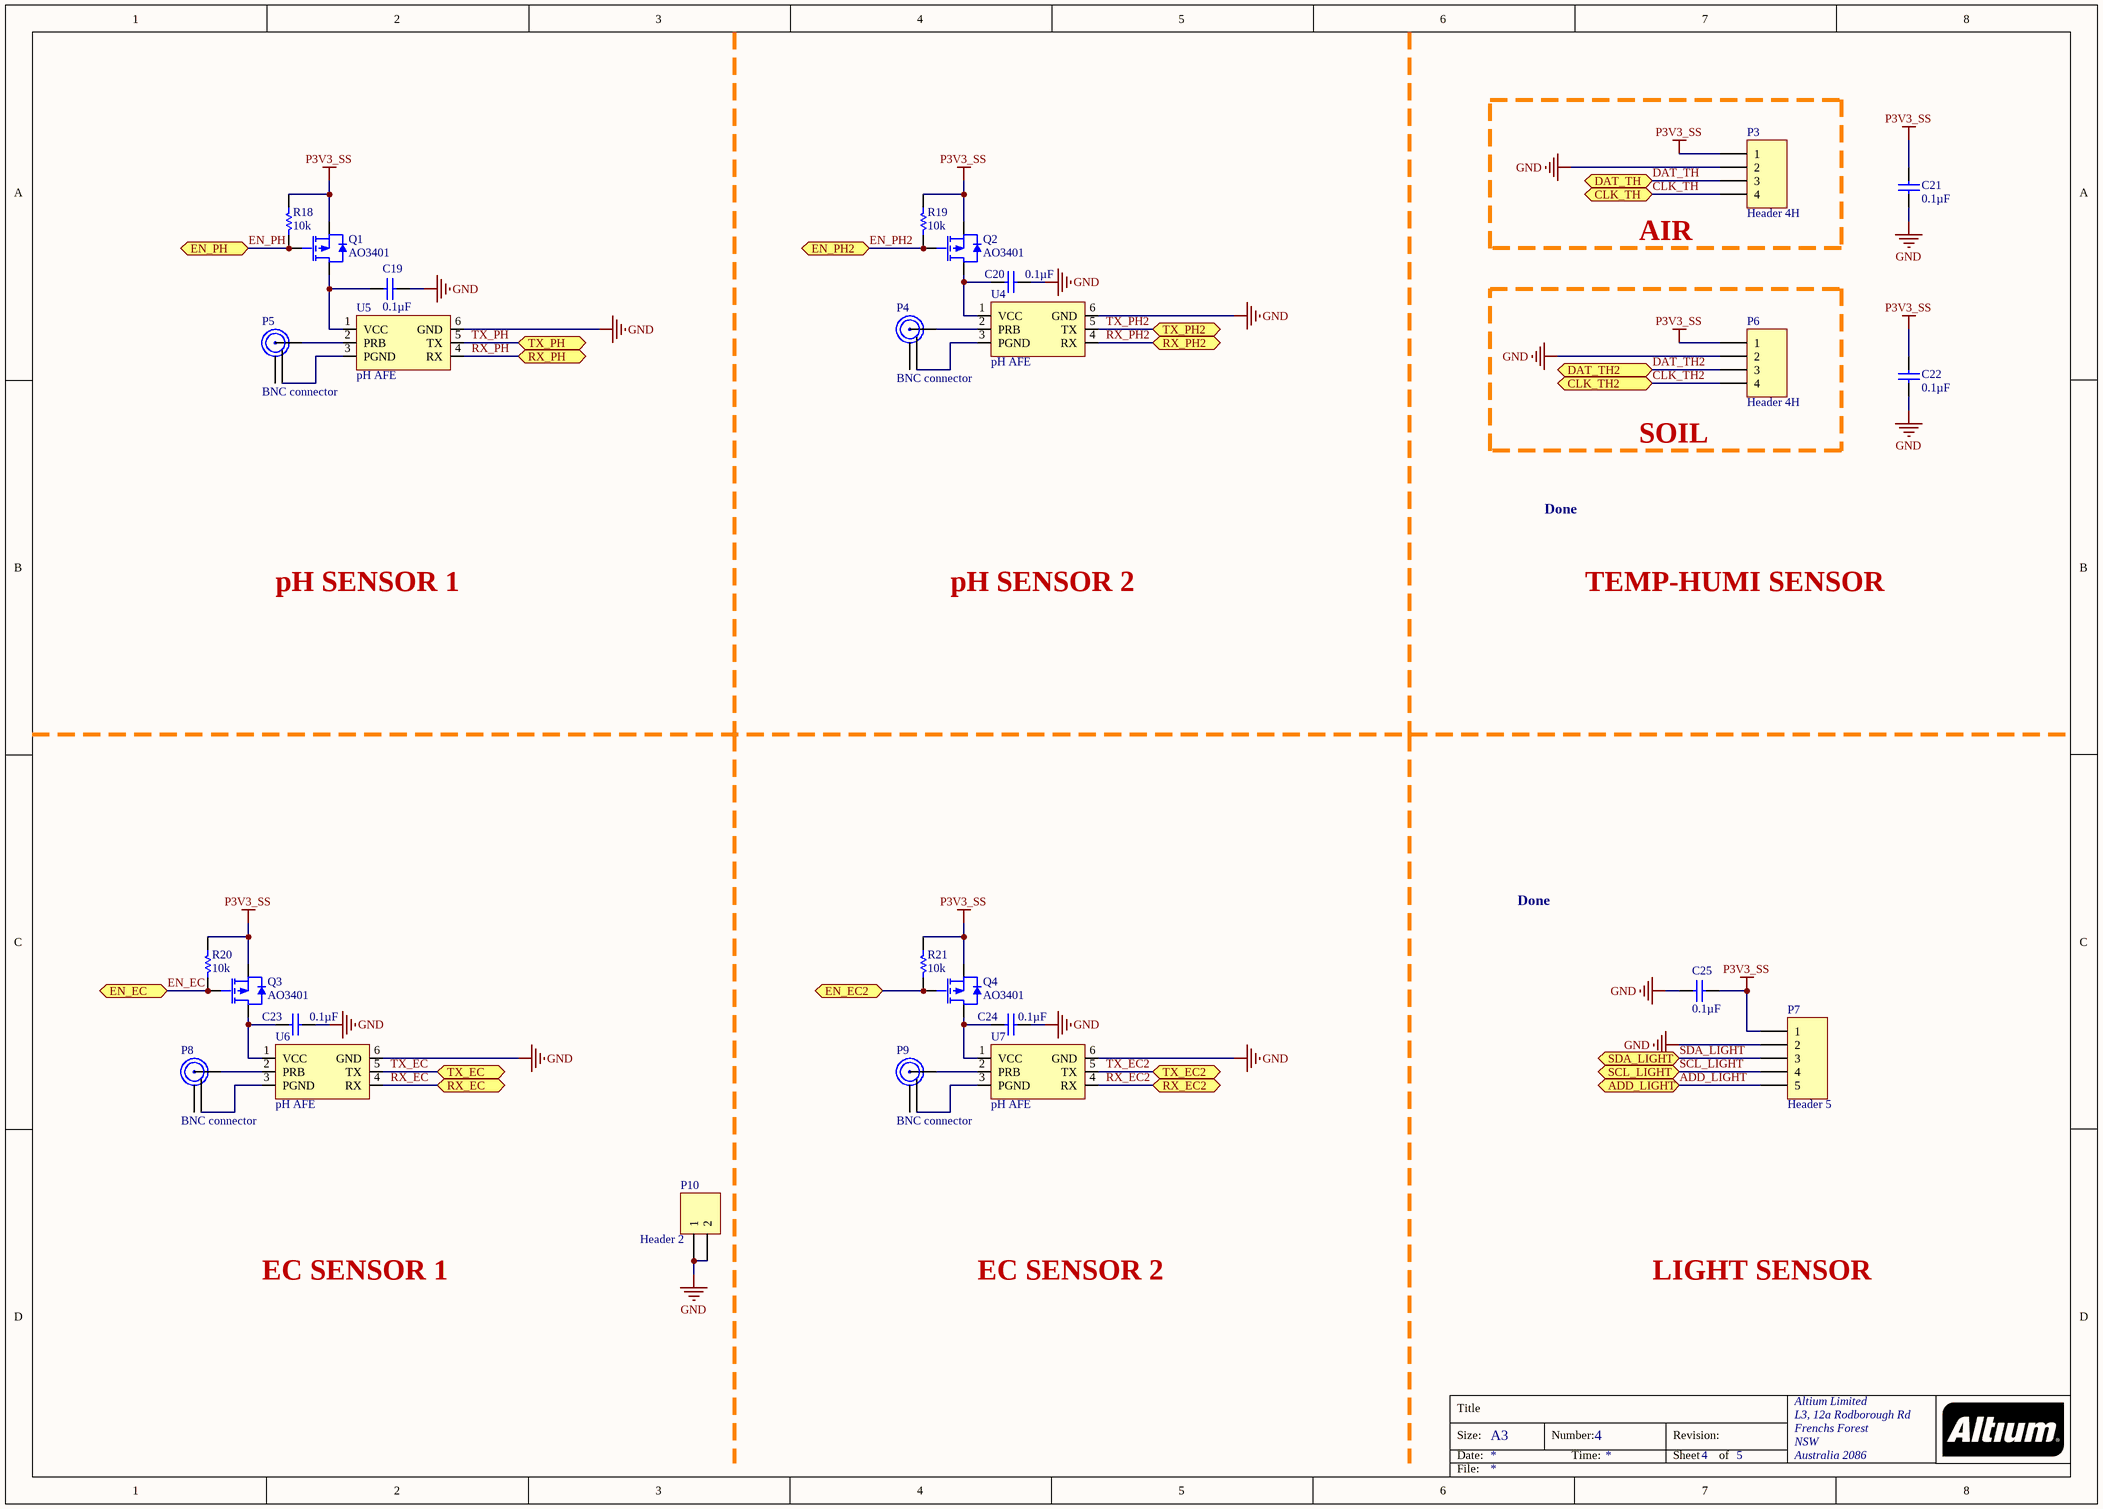
[diagram p2: SENSOR.SchDoc]

### Parts
C19  0.1µF  [C0402M]
C20  0.1µF  [C0402M]
C21  0.1µF  [C0402M]
C22  0.1µF  [C0402M]
C23  0.1µF  [C0402M]
C24  0.1µF  [C0402M]
C25  0.1µF  [C0402M]
P3  Header 4H  [TERMINAL4_5.08]
P4  BNC connector  [BNC]
P5  BNC connector  [BNC]
P6  Header 4H  [TERMINAL4_5.08]
P7  Header 5  [TERMINAL5_5.08]
P8  BNC connector  [BNC]
P9  BNC connector  [BNC]
P10  Header 2  [HED2T]
Q1  AO3401  [SOT23-3N]
Q2  AO3401  [SOT23-3N]
Q3  AO3401  [SOT23-3N]
Q4  AO3401  [SOT23-3N]
R18  10k  [R0603M]
R19  10k  [R0603M]
R20  10k  [R0603M]
R21  10k  [R0603M]
U4  pH AFE  [pH AFE]
U5  pH AFE  [pH AFE]
U6  pH AFE  [pH AFE]
U7  pH AFE  [pH AFE]

### Blocks framed on the sheet
AIR: P3
SOIL: P6

### Ports
ADD_LIGHT, CLK_TH, CLK_TH2, DAT_TH, DAT_TH2, EN_EC, EN_EC2, EN_PH, EN_PH2, RX_EC, RX_EC2, RX_PH, RX_PH2, SCL_LIGHT, SDA_LIGHT, TX_EC, TX_EC2, TX_PH, TX_PH2

### Nets
GND: C19.1 C20.1 C21.1 C22.1 C23.1 C24.1 C25.1 P3.2 P6.2 P7.2 P10.1 P10.2 U4.6(GND) U5.6(GND) U6.6(GND) U7.6(GND)
P3V3_SS: C21.2 C22.2 C25.2 P3.1 P6.1 P7.1 Q1.2(S) Q2.2(S) Q3.2(S) Q4.2(S) R18.2 R19.2 R20.2 R21.2
ADD_LIGHT: P7.5 ; port ADD_LIGHT
CLK_TH: P3.4 ; port CLK_TH
CLK_TH2: P6.4 ; port CLK_TH2
DAT_TH: P3.3 ; port DAT_TH
DAT_TH2: P6.3 ; port DAT_TH2
EN_EC: Q3.1(G) R20.1 ; port EN_EC
EN_PH: Q1.1(G) R18.1 ; port EN_PH
EN_PH2: Q2.1(G) R19.1 ; port EN_PH2
RX_EC: U6.4(RX) ; port RX_EC
RX_EC2: U7.4(RX) ; port RX_EC2
RX_PH: U5.4(RX) ; port RX_PH
RX_PH2: U4.4(RX) ; port RX_PH2
SCL_LIGHT: P7.4 ; port SCL_LIGHT
SDA_LIGHT: P7.3 ; port SDA_LIGHT
TX_EC: U6.5(TX) ; port TX_EC
TX_EC2: U7.5(TX) ; port TX_EC2
TX_PH: U5.5(TX) ; port TX_PH
TX_PH2: U4.5(TX) ; port TX_PH2
NetC19_2: C19.2 Q1.3(D) U5.1(VCC)
NetC20_2: C20.2 Q2.3(D) U4.1(VCC)
NetC23_2: C23.2 Q3.3(D) U6.1(VCC)
NetC24_2: C24.2 Q4.3(D) U7.1(VCC)
NetP4_1: P4.1 U4.2(PRB)
NetP4_2: P4.2 U4.3(PGND)
NetP5_1: P5.1 U5.2(PRB)
NetP5_2: P5.2 U5.3(PGND)
NetP8_1: P8.1 U6.2(PRB)
NetP8_2: P8.2 U6.3(PGND)
NetP9_1: P9.1 U7.2(PRB)
NetP9_2: P9.2 U7.3(PGND)
NetQ4_1: Q4.1(G) R21.1 ; port EN_EC2

Not connected (* = marked no-connect by the designer): P4 3; P5 3; P8 3; P9 3

### Notes on the sheet
- Done
- pH SENSOR 1
- pH SENSOR 2
- TEMP-HUMI SENSOR
- EC SENSOR 1
- EC SENSOR 2
- LIGHT SENSOR
- Title
- Size:
- Date:
- A3
- Number:
- Time:
- Revision:
- Sheet
- of
- File:

### Library data of the parts
C19-C25 = CAP0.1u0402: as C1 on sheet POWER; Supplier 1: Digi-Key; RoHS: RoHS Compliant; Category: Capacitors; Stock 1: 23930; Pricing 1: 1=0.1, 10=0.05, 100=0.0223, 500=0.01594, 1000=0.01252, 2500=0.01138, 5000=0.01047 (USD); Packaging: Cut Tape (CT); Part Status: Active; Capacitance: 0.1µF; Voltage - Rated: 10V; Temperature Coefficient: X7R; Operating Temperature: -55°C ~ 125°C; Features: -; Ratings: AEC-Q200; Applications: Automotive; Mounting Type: Surface Mount, MLCC; Package / Case: 0402 (1005 Metric); Size / Dimension: 0.039" L x 0.020" W (1.00mm x 0.50mm); Height - Seated (Max): -; Thickness (Max): 0.022" (0.55mm); Lead Spacing: -; Lead Style: -; ComponentLink1URL: http://www.yuden.co.jp/productdata/catalog/en/mlcc_all_hq_e.pdf; ComponentLink1Description: http://www.yuden.co.jp/productdata/catalog/en/mlcc_all_hq_e.pdf; Supplier Part Number 1: 587-3769-1-ND
P3 P6 = Header 4H: TERM BLOCK PLUG 4POS STR 5.08MM; Manufacturer: Phoenix Contact; Manufacturer Part Number: 1758377; Number of Positions: 4; Number of Levels: 1; Pitch: 0.200" (5.08mm); Plug Wire Entry: 180°; Current - IEC: 12A; Wire Gauge or Range - AWG: 12-30 AWG; Wire Gauge or Range - mm²: 0.2-2.5mm²; Material Flammability Rating: UL94 V-0; Screw Size: M3; Torque - Screw: 0.5-0.6 Nm (4.4-5.3 Lb-In); Wire Strip Length: 7mm; LatestRevisionDate: 17-Jul-2002; LatestRevisionNote: Re-released for DXP Platform.; Publisher: Altium Limited; Supplier 1: Digi-Key; Supplier Part Number 1: 277-1966-ND; RoHS: RoHS Compliant; Category: Connectors, Interconnects; Stock 1: 185; Pricing 1: 1=4.13, 10=3.949, 50=3.8412, 100=3.59, 250=3.30284, 500=3.0515, 1000=2.90793, 2500=2.7284 (USD); Packaging: Bulk; Part Status: Active; Type: Plug, Female Sockets; Positions Per Level: 4; Header Orientation: -; Termination Style: Screw - Clamping Yoke (Tension Sleeve); Mounting Type: Free Hanging (In-Line); Color: Green; Operating Temperature: -; Contact Mating Finish: Tin; Features: Positions Stamped, Retention Latches (Non-Wire Side); Ingress Protection: -; Contact Material: -; Housing Material: Polyamide (PA), Nylon; Contact Tail Length: -; Insulation Height: 0.591" (15.00mm); ComponentLink1URL: https://media.digikey.com/PDF/Data%20Sheets/Phoenix%20Contact%20PDFs/1758377.pdf; ComponentLink1Description: https://media.digikey.com/PDF/Data%20Sheets/Phoenix%20Contact%20PDFs/1758377.pdf
P7 = Header 5: TERM BLOCK PLUG 5POS STR 5.08MM; Manufacturer: Phoenix Contact; Manufacturer Part Number: 1757048; Number of Positions: 5; Number of Levels: 1; Pitch: 0.200" (5.08mm); Plug Wire Entry: 180°; Current - IEC: 12A; Wire Gauge or Range - AWG: 12-30 AWG; Wire Gauge or Range - mm²: 0.2-2.5mm²; Material Flammability Rating: UL94 V-0; Screw Size: M3; Torque - Screw: 0.5-0.6 Nm (4.4-5.3 Lb-In); Wire Strip Length: 7mm; LatestRevisionDate: 17-Jul-2002; LatestRevisionNote: Re-released for DXP Platform.; Publisher: Altium Limited; Supplier 1: Digi-Key; Supplier Part Number 1: 277-1014-ND; RoHS: RoHS Compliant; Category: Connectors, Interconnects; Stock 1: 1718; Pricing 1: 1=4.69, 10=4.488, 50=4.3656, 100=4.08, 250=3.75364, 500=3.46802, 1000=3.30483, 2500=3.1008 (USD); Packaging: Bulk; Part Status: Active; Type: Plug, Female Sockets; Positions Per Level: 5; Header Orientation: -; Termination Style: Screw - Clamping Yoke (Tension Sleeve); Mounting Type: Free Hanging (In-Line); Color: Green; Operating Temperature: -; Contact Mating Finish: Tin; Features: Retention Latches (Non-Wire Side); Ingress Protection: -; Contact Material: -; Housing Material: Polyamide (PA), Nylon; Contact Tail Length: -; Insulation Height: 0.591" (15.00mm); ComponentLink1URL: https://media.digikey.com/pdf/Data%20Sheets/Phoenix%20Contact%20PDFs/1757048.pdf; ComponentLink1Description: https://media.digikey.com/pdf/Data%20Sheets/Phoenix%20Contact%20PDFs/1757048.pdf
P10 = Header 2: Header, 2-Pin; LatestRevisionDate: 17-Jul-2002; LatestRevisionNote: Re-released for DXP Platform.; Publisher: Altium Limited
Q1-Q4 = MOSFET-P1: P-Channel MOSFET
R18-R21 = RES10k0603: as R6 on sheet MCU; Supplier 1: Digi-Key; RoHS: RoHS Compliant; Category: Resistors; Stock 1: 0; Pricing 1: 1=0.1, 10=0.021, 100=0.0087, 1000=0.00389, 2500=0.00338 (USD); Packaging: Digi-Reel®; Part Status: Active; Resistance (Ohms): 10k; Tolerance: ±1%; Composition: Thick Film; Features: Automotive AEC-Q200; Operating Temperature: -55°C ~ 155°C; Package / Case: 0603 (1608 Metric); Supplier Device Package: 0603; Size / Dimension: 0.063" L x 0.031" W (1.60mm x 0.80mm); Height - Seated (Max): 0.022" (0.55mm); Failure Rate: -; ComponentLink1URL: https://industrial.panasonic.com/cdbs/www-data/pdf/RDA0000/AOA0000C298.pdf; ComponentLink1Description: https://industrial.panasonic.com/cdbs/www-data/pdf/RDA0000/AOA0000C298.pdf; Supplier Part Number 1: P10.0KHDKR-ND

## Sheet CONNECTIVITY.SchDoc
size A3; Organization: Altium Limited; Address1: L3, 12a Rodborough Rd; Address2: Frenchs Forest; Address3: NSW; Address4: Australia 2086; DocumentNumber: 5; SheetNumber: 5; SheetTotal: 5
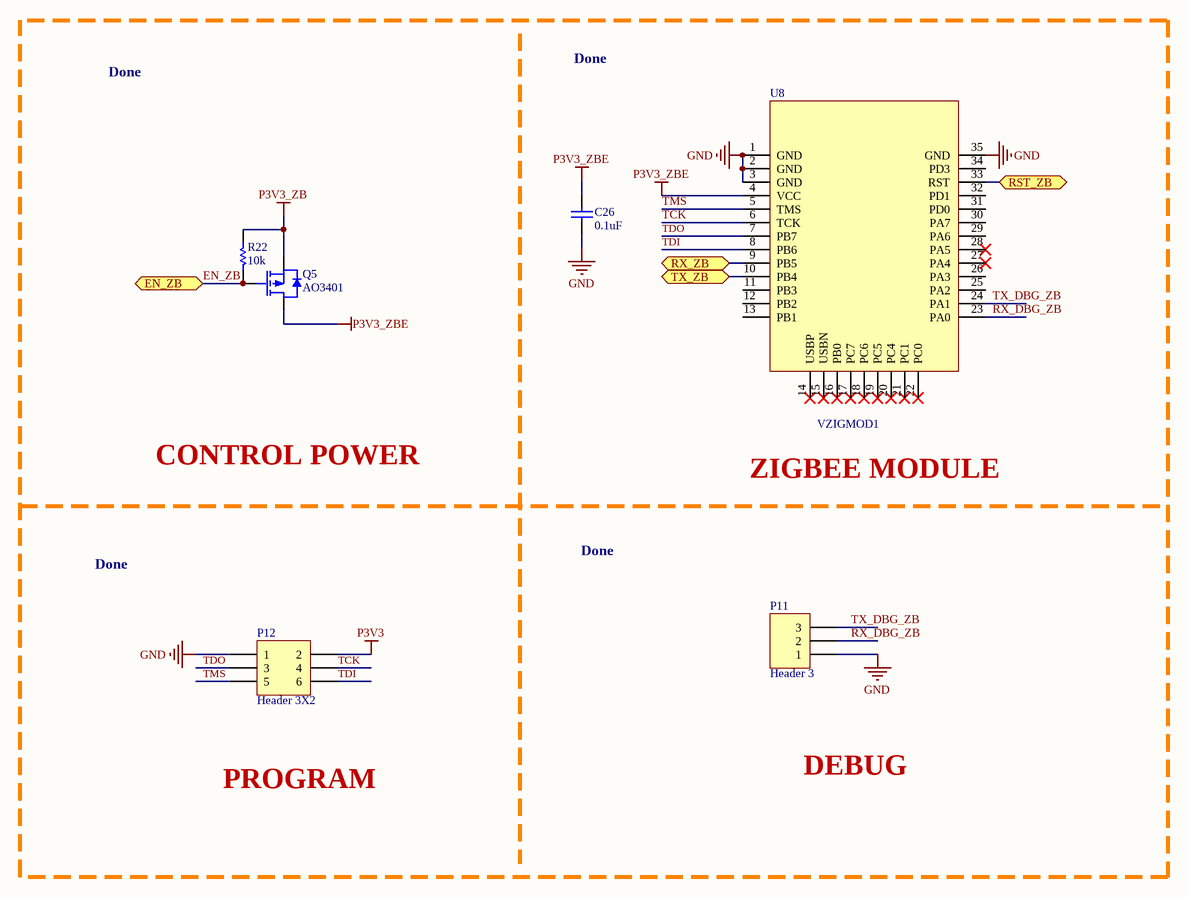
[diagram p3: CONNECTIVITY.SchDoc]

### Parts
C26  0.1uF  [C0402M]
P11  Header 3  [HDR1X3]
P12  Header 3X2  [HDR2X3]
Q5  AO3401  [SOT23-3N]
R22  10k  [R0603M]
U8  VZIGMOD1  [VZIGMOD2]

### Ports
EN_ZB, RST_ZB, RX_ZB, TX_ZB

### Nets
GND: C26.1 P11.1 P12.1 U8.1(GND) U8.2(GND) U8.3(GND) U8.35(GND)
P3V3: P12.2
P3V3_ZB: Q5.2(S) R22.2
P3V3_ZBE: C26.2 Q5.3(D) U8.4(VCC)
EN_ZB: Q5.1(G) R22.1 ; port EN_ZB
RX_DBG_ZB: P11.2 U8.23(PA0)
TCK: P12.4 U8.6(TCK)
TDI: P12.6 U8.8(PB6)
TDO: P12.3 U8.7(PB7)
TMS: P12.5 U8.5(TMS)
TX_DBG_ZB: P11.3 U8.24(PA1)
NetU2_84: U8.33(RST) ; port RST_ZB
NetU2_86: U8.10(PB4) ; port TX_ZB
NetU2_87: U8.9(PB5) ; port RX_ZB

Not connected (* = marked no-connect by the designer): U8 11(PB3) 12(PB2) 13(PB1) 14(USBP)* 15(USBN)* 16(PB0)* 17(PC7)* 18(PC6)* 19(PC5)* 20(PC4)* 21(PC1)* 22(PC0)* 25(PA2) 26(PA3) 27(PA4)* 28(PA5)* 29(PA6) 30(PA7) 31(PD0) 32(PD1) 34(PD3)

### Notes on the sheet
- Done
- CONTROL POWER
- ZIGBEE MODULE
- PROGRAM
- DEBUG
- Title
- Size:
- Date:
- A3
- Number:
- Time:
- Revision:
- Sheet
- of
- File:

### Library data of the parts
C26 = CAP0.1u0402: CAP CER 0.1UF 16V X7R 0402; Manufacturer: Samsung Electro-Mechanics; Manufacturer Part Number: CL05B104KO5NNNC; Tolerance: ±10%; Notification: Current market demand for these product types have resulted in fluctuating and extending lead times. Lead times may differ.; Module: Connectivity; Supplier 1: Digi-Key; Supplier Part Number 1: 1276-1001-6-ND; RoHS: RoHS Compliant; Category: Capacitors; Stock 1: 100000; Pricing 1: 1=0.1, 10=0.03, 100=0.0134, 500=0.00958, 1000=0.00753, 2500=0.00684, 5000=0.0063 (USD); Packaging: Digi-Reel®; Part Status: Active; Voltage - Rated: 16V; Temperature Coefficient: X7R; Operating Temperature: -55°C ~ 125°C; Features: -; Ratings: -; Applications: General Purpose; Mounting Type: Surface Mount, MLCC; Package / Case: 0402 (1005 Metric); Size / Dimension: 0.039" L x 0.020" W (1.00mm x 0.50mm); Height - Seated (Max): -; Thickness (Max): 0.022" (0.55mm); Lead Spacing: -; Lead Style: -; ComponentLink1URL: http://www.samsungsem.com/kr/support/product-search/mlcc/CL05B104KO5NNNC.jsp; ComponentLink1Description: http://www.samsungsem.com/kr/support/product-search/mlcc/CL05B104KO5NNNC.jsp
P11 = Header 3: Header, 3-Pin; LatestRevisionDate: 17-Jul-2002; LatestRevisionNote: Re-released for DXP Platform.; Publisher: Altium Limited
P12 = Header 3X2: Header, 3-Pin, Dual row; LatestRevisionDate: 17-Jul-2002; LatestRevisionNote: Re-released for DXP Platform.; Publisher: Altium Limited
Q5 = MOSFET-P1: P-Channel MOSFET
R22 = RES10k0603: as R6 on sheet MCU; Supplier 1: Digi-Key; RoHS: RoHS Compliant; Category: Resistors; Stock 1: 0; Pricing 1: 1=0.1, 10=0.021, 100=0.0087, 1000=0.00389, 2500=0.00338 (USD); Packaging: Digi-Reel®; Part Status: Active; Resistance (Ohms): 10k; Tolerance: ±1%; Composition: Thick Film; Features: Automotive AEC-Q200; Operating Temperature: -55°C ~ 155°C; Package / Case: 0603 (1608 Metric); Supplier Device Package: 0603; Size / Dimension: 0.063" L x 0.031" W (1.60mm x 0.80mm); Height - Seated (Max): 0.022" (0.55mm); Failure Rate: -; ComponentLink1URL: https://industrial.panasonic.com/cdbs/www-data/pdf/RDA0000/AOA0000C298.pdf; ComponentLink1Description: https://industrial.panasonic.com/cdbs/www-data/pdf/RDA0000/AOA0000C298.pdf; Supplier Part Number 1: P10.0KHDKR-ND
U8 = VZIGMOD2: VNPT ZIGBEE MODULE V1 - No-PA; Manufacturer: VNPT-Technology; Utilized IC / Part: CC2538; Catgory: RF/IF and RFID; Sensitivity: -99dBm; Data Rate: 250kbps; Frequency: 2.4GHz; Power - Output: 7dBm; Serial Interfaces: I²C, SPI, UART; Antenna Type: Integrated, PCB, External; Voltage - Supply: 1.85 V ~ 3.8 V; Module: Connectivity; Manufacturer Part Number: VZIGMOD1; Mounting Type: Surface Mount; Operating Temperature: -40°C ~ 85°C; Package / Case: 33-SMD Module

## Nets that join several sheets
GND: POWER (13 pins), MCU (31 pins), SENSOR (16 pins), CONNECTIVITY (7 pins)
P3V3: POWER (11 pins), MCU (P2.1 P2.2), CONNECTIVITY (P12.2)
P3V3_MCU: POWER (R1.2), MCU (29 pins)
P3V3_SS: POWER (R2.2), SENSOR (14 pins)
P3V3_ZB: POWER (R4.2), CONNECTIVITY (Q5.2 R22.2)
ADD_LIGHT: MCU (U2.33), SENSOR (P7.5)
CLK_TH: MCU (R10.1 U2.82), SENSOR (P3.4)
CLK_TH2: MCU (R12.1 U2.42), SENSOR (P6.4)
DAT_TH: MCU (R9.1 U2.83), SENSOR (P3.3)
DAT_TH2: MCU (R11.1 U2.43), SENSOR (P6.3)
EN_EC: MCU (U2.92), SENSOR (Q3.1 R20.1)
EN_PH: MCU (U2.72), SENSOR (Q1.1 R18.1)
EN_PH2: MCU (U2.94), SENSOR (Q2.1 R19.1)
EN_ZB: MCU (U2.85), CONNECTIVITY (Q5.1 R22.1)
NetQ4_1: MCU (U2.64), SENSOR (Q4.1 R21.1)
NetU2_84: MCU (U2.84), CONNECTIVITY (U8.33)
NetU2_86: MCU (U2.86), CONNECTIVITY (U8.10)
NetU2_87: MCU (U2.87), CONNECTIVITY (U8.9)
RX_EC: MCU (U2.91), SENSOR (U6.4)
RX_EC2: MCU (P2.6 U2.63), SENSOR (U7.4)
RX_PH: MCU (U2.76), SENSOR (U5.4)
RX_PH2: MCU (U2.96), SENSOR (U4.4)
SCL_LIGHT: MCU (R7.1 U2.31), SENSOR (P7.4)
SDA_LIGHT: MCU (R8.1 U2.32), SENSOR (P7.3)
TX_EC: MCU (U2.90), SENSOR (U6.5)
TX_EC2: MCU (P2.8 U2.62), SENSOR (U7.5)
TX_PH: MCU (U2.73), SENSOR (U5.5)
TX_PH2: MCU (U2.95), SENSOR (U4.5)